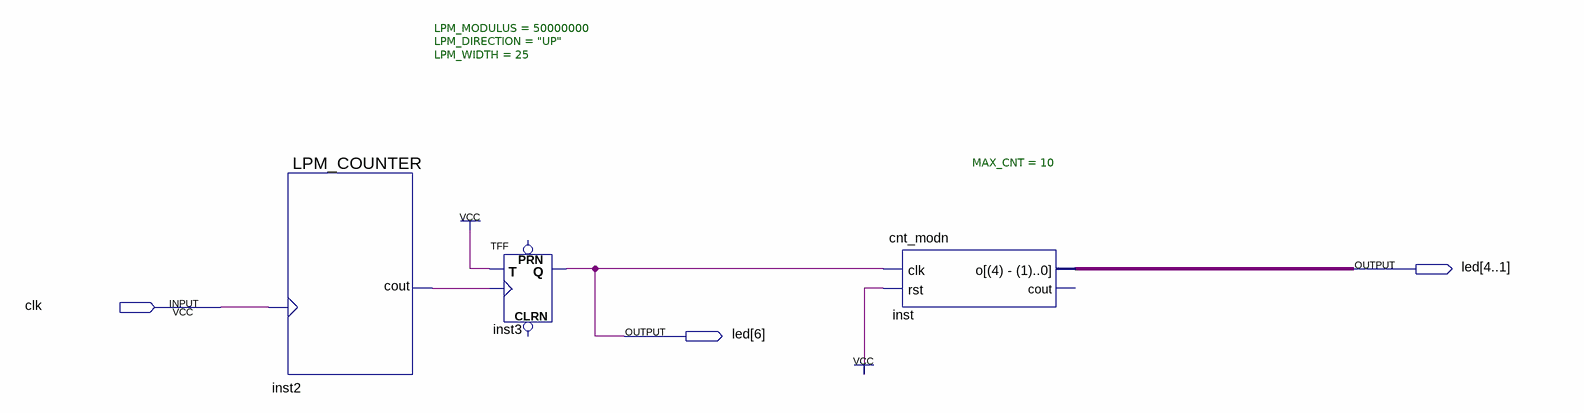
[diagram p0: schematic sheet]
// Quartus schematic cofre.bdf as structural Verilog: 3 symbols, 3 pins
module cofre (
  input  clk,
  output [6:1] led
);

  wire inst2_cout;

  LPM_COUNTER #(.LPM_MODULUS(50000000), .LPM_DIRECTION("UP"), .LPM_WIDTH(25)) inst2 (.clock(clk), .cout(inst2_cout));
  TFF inst3 (.T(1'b1), .CLK(inst2_cout), .Q(led[6]));  // open: PRN, CLRN
  cnt_modn #(.MAX_CNT(10)) inst (.clk(led[6]), .rst(1'b1), .\o[(4)_-_(1)..0] (led[4:1]));  // open: cout
endmodule
